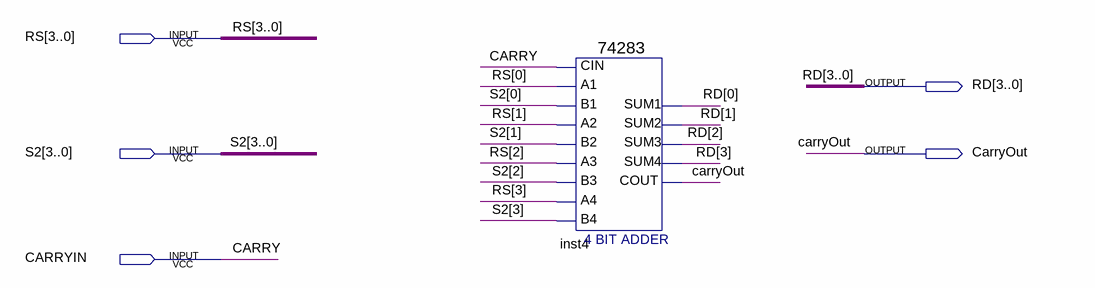
[diagram p0: schematic sheet]
// Quartus schematic Group03_2023510056_ALU_ADDER.bdf as structural Verilog: 1 symbols, 5 pins
module Group03_2023510056_ALU_ADDER (
  input  [3:0] RS,
  input  [3:0] S2,
  input  CARRYIN,
  output [3:0] RD,
  output CarryOut
);

  \74283  inst4 (
    .CIN(CARRYIN), .A1(RS[0]), .A2(RS[1]), .B2(S2[1]), .A3(RS[2]), .A4(RS[3]), .B4(S2[3]), .B1(S2[0]),
    .B3(S2[2]), .SUM4(RD[3]), .COUT(CarryOut), .SUM1(RD[0]), .SUM2(RD[1]), .SUM3(RD[2]));

  // Other names for the same wires on the sheet: CARRY = CARRYIN
endmodule
